# Altium schematic sheet 8.ESP32.SchDoc
size A4; SheetNumber: 9; SheetTotal: 13
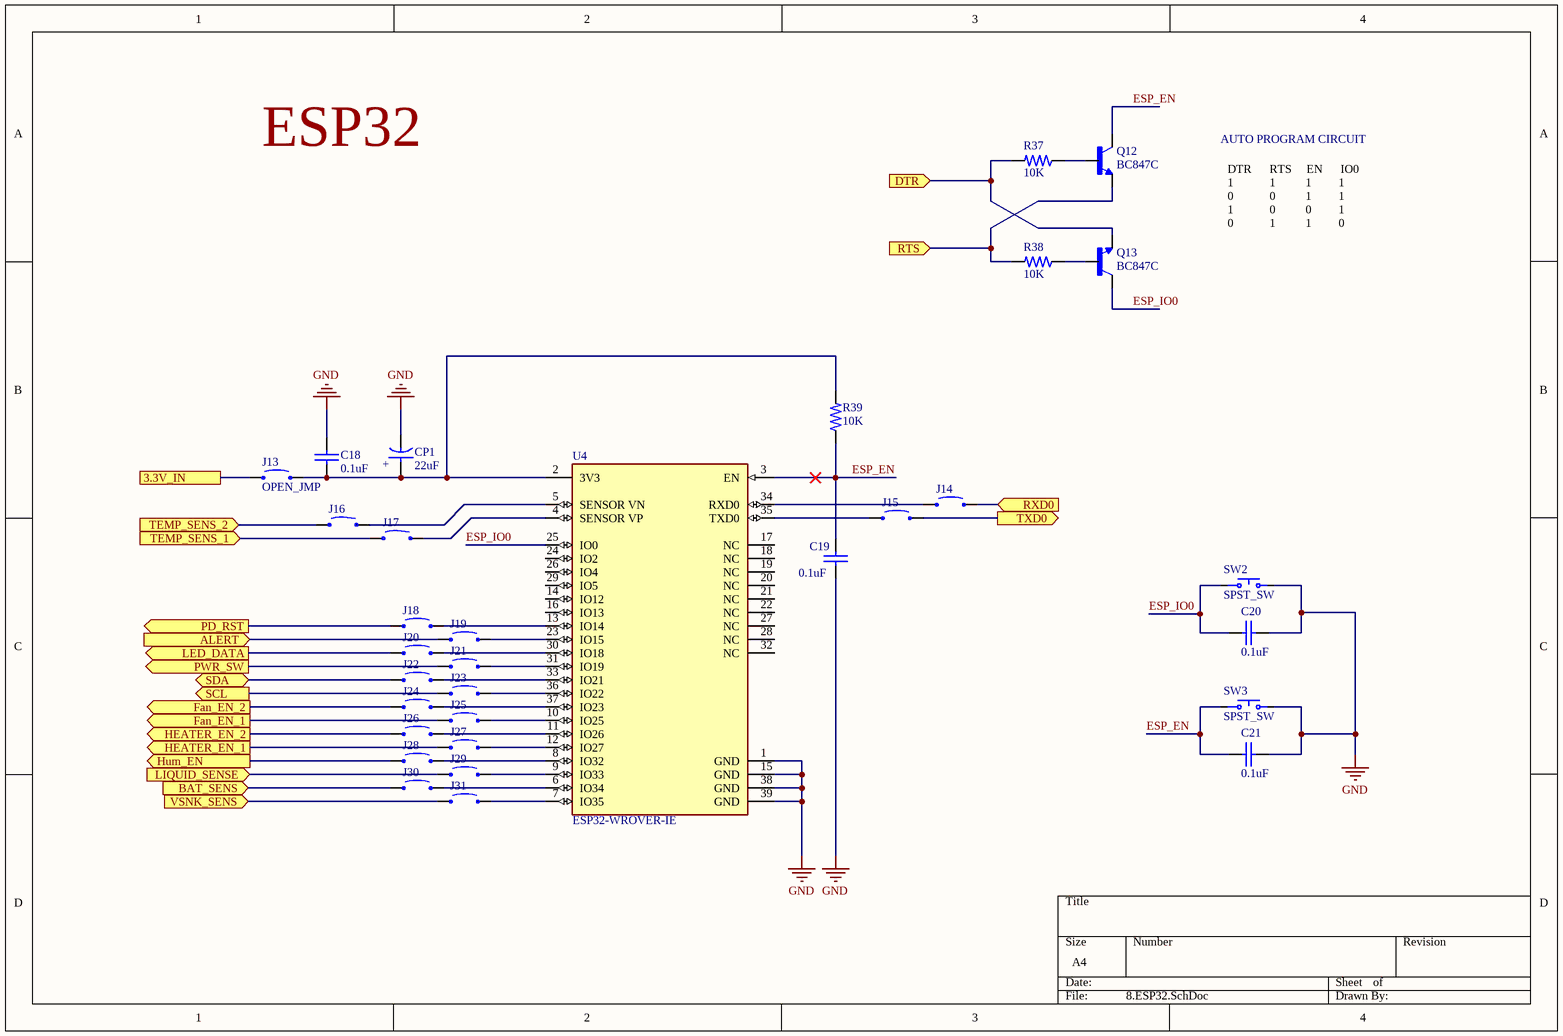
[diagram p0: 8.ESP32.SchDoc]

## Parts
C18  0.1uF  [C_0603]
C19  0.1uF  [C_0603]
C20  0.1uF  [C_0603]
C21  0.1uF  [C_0603]
CP1  22uF
J13  OPEN_JMP  [OPEN_JMP]
J14  OPEN_JMP  [OPEN_JMP]  (value not drawn)
J15  OPEN_JMP  [OPEN_JMP]  (value not drawn)
J16  OPEN_JMP  [OPEN_JMP]  (value not drawn)
J17  OPEN_JMP  [OPEN_JMP]  (value not drawn)
J18  OPEN_JMP  [OPEN_JMP]  (value not drawn)
J19  OPEN_JMP  [OPEN_JMP]  (value not drawn)
J20  OPEN_JMP  [OPEN_JMP]  (value not drawn)
J21  OPEN_JMP  [OPEN_JMP]  (value not drawn)
J22  OPEN_JMP  [OPEN_JMP]  (value not drawn)
J23  OPEN_JMP  [OPEN_JMP]  (value not drawn)
J24  OPEN_JMP  [OPEN_JMP]  (value not drawn)
J25  OPEN_JMP  [OPEN_JMP]  (value not drawn)
J26  OPEN_JMP  [OPEN_JMP]  (value not drawn)
J27  OPEN_JMP  [OPEN_JMP]  (value not drawn)
J28  OPEN_JMP  [OPEN_JMP]  (value not drawn)
J29  OPEN_JMP  [OPEN_JMP]  (value not drawn)
J30  OPEN_JMP  [OPEN_JMP]  (value not drawn)
J31  OPEN_JMP  [OPEN_JMP]  (value not drawn)
Q12  BC847C  [SOT-23-3]
Q13  BC847C  [SOT-23-3]
R37  10K  [R_0603]
R38  10K  [R_0603]
R39  10K  [R_0603]
SW2  SPST_SW  [PTS636 SM43J SMTR LFS]
SW3  SPST_SW  [PTS636 SM43J SMTR LFS]
U4  ESP32-WROVER-IE  [ESP32-WROVER-IE]

## Ports
3.3V_IN, ALERT (in), BAT_SENS (in), DTR (in), Fan_EN_1 (out), Fan_EN_2 (out), HEATER_EN_1 (out), HEATER_EN_2 (out), Hum_EN (out), LED_DATA (out), LIQUID_SENSE (in), PD_RST (out), PWR_SW (out), RTS (in), RXD0 (in), SCL (out), SDA (bidir), TEMP_SENS_1 (in), TEMP_SENS_2 (in), TXD0 (out), VSNK_SENS (in)

## Nets
GND: C18.2 C19.1 C20.1 C21.1 CP1.2 SW2.2(NO) SW3.2(NO) U4.1(GND) U4.15(GND) U4.38(GND) U4.39(GND)
3.3V_IN: J13.1 ; port 3.3V_IN
ALERT: J19.1 ; port ALERT
BAT_SENS: J30.1 ; port BAT_SENS
DTR: Q13.2(E) R37.2 ; port DTR
ESP_EN: C19.2 C21.2 Q12.3(C) R39.1 SW3.1(COM) U4.3(EN)
ESP_IO0: C20.2 Q13.3(C) SW2.1(COM) U4.25(IO0)
Fan_EN_1: J25.1 ; port Fan_EN_1
Fan_EN_2: J24.1 ; port Fan_EN_2
HEATER_EN_1: J27.1 ; port HEATER_EN_1
HEATER_EN_2: J26.1 ; port HEATER_EN_2
Hum_EN: J28.1 ; port Hum_EN
LED_DATA: J20.1 ; port LED_DATA
LIQUID_SENSE: J29.1 ; port LIQUID_SENSE
PD_RST: J18.1 ; port PD_RST
PWR_SW: J21.1 ; port PWR_SW
RTS: Q12.2(E) R38.2 ; port RTS
RXD0: J14.2 ; port RXD0
SCL: J23.1 ; port SCL
SDA: J22.1 ; port SDA
TEMP_SENS_1: J17.1 ; port TEMP_SENS_1
TEMP_SENS_2: J16.1 ; port TEMP_SENS_2
TXD0: J15.2 ; port TXD0
VSNK_SENS: J31.1 ; port VSNK_SENS
NetC18_1: C18.1 CP1.1 J13.2 R39.2 U4.2(3V3)
NetJ14_1: J14.1 U4.34(RXD0)
NetJ15_1: J15.1 U4.35(TXD0)
NetJ16_2: J16.2 U4.5(SENSOR_VN)
NetJ17_2: J17.2 U4.4(SENSOR_VP)
NetJ18_2: J18.2 U4.13(IO14)
NetJ19_2: J19.2 U4.23(IO15)
NetJ20_2: J20.2 U4.30(IO18)
NetJ21_2: J21.2 U4.31(IO19)
NetJ22_2: J22.2 U4.33(IO21)
NetJ23_2: J23.2 U4.36(IO22)
NetJ24_2: J24.2 U4.37(IO23)
NetJ25_2: J25.2 U4.10(IO25)
NetJ26_2: J26.2 U4.11(IO26)
NetJ27_2: J27.2 U4.12(IO27)
NetJ28_2: J28.2 U4.8(IO32)
NetJ29_2: J29.2 U4.9(IO33)
NetJ30_2: J30.2 U4.6(IO34)
NetJ31_2: J31.2 U4.7(IO35)
NetQ12_1: Q12.1(B) R37.1
NetQ13_1: Q13.1(B) R38.1

Not connected (* = marked no-connect by the designer): U4 14(IO12) 16(IO13) 17(NC) 18(NC) 19(NC) 20(NC) 21(NC) 22(NC) 24(IO2) 26(IO4) 27(NC) 28(NC) 29(IO5) 32(NC)

## Notes on the sheet
- ESP32
- AUTO PROGRAM CIRCUIT
- DTR      RTS     EN      IO0                                                 1            1          1         1                                              0            0          1         1                                                   1            0          0         1                                        0            1          1         0
- (in symbol CP) +

## Library data of the parts
C18-C21 = C_0603: D: *; MFR: *; P: *; PN: *; URL: *
CP1 = CP
Q12 Q13 = BC847C: MFR: Nexperia; D: Bipolar Transistors - BJT BC847C/SOT23/TO-236AB; PN: BC847C,215; P: SOT-23-3; URL: https://www.mouser.in/ProductDetail/Nexperia/BC847C215?qs=me8TqzrmIYVnv3C18%2Fxa3Q%3D%3D
R37-R39 = R_0603: D: *; MFR: *; P: *; PN: *; URL: *
SW2 SW3 = SPST_SW: MFR: C&K; D: Tactile Switches Tact 50mA 12VDC, 6.0x3.5, 4.3mm H, 180gf, J leads, No ground pin, Black Actuator; PN: PTS636 SM43J SMTR LFS; P: *; URL: https://www.mouser.in/ProductDetail/CK/PTS636-SM43J-SMTR-LFS?qs=vLWxofP3U2wboJ6ciMafNg%3D%3D
U4 = ESP32-WROVER-IE: MFR: Espressif Systems; D: Multiprotocol Modules SMD Module ESP32-WROVER-IE, ESP32-D0WD-V3, 3.3V 64Mbit PSRAM, 16 MB SPI flash, IPEX connector; PN: ESP32-WROVER-IE-N16R8; P: *; URL: https://www.mouser.in/ProductDetail/Espressif-Systems/ESP32-WROVER-IE-N16R8?qs=sGAEpiMZZMu3sxpa5v1qrkR%2F6t0IkXq8TEHvlzz2yS8%3D